# Altium schematic sheet [12] - RTC.SchDoc
size A4; Organization: Altium Limited; Address1: L3, 12a Rodborough Rd; Address2: Frenchs Forest; Address3: NSW; Address4: Australia 2086
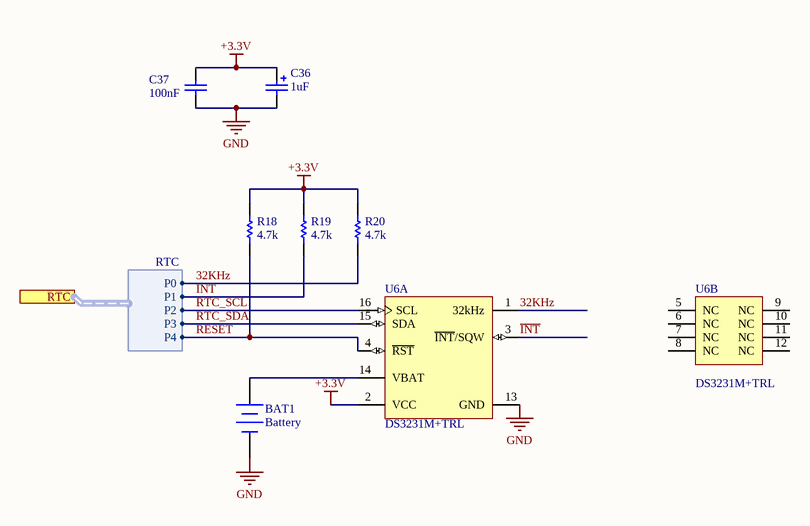
[diagram p0: [12] - RTC.SchDoc]

## Parts
BAT1  Battery  [Bat]
C36  Capacitance: 1uF  [Tantalum 3216 A]  (hidden comment: Capacitor Polarized)
C37  Capacitance: 100nF  [Cap 0603]  (hidden comment: Capacitor)
R18  Resistance: 4.7k  [Res-0603]  (hidden comment: Res1)
R19  Resistance: 4.7k  [Res-0603]  (hidden comment: Res1)
R20  Resistance: 4.7k  [Res-0603]  (hidden comment: Res1)
U6  DS3231M+TRL  [W16MK+1_N]  (parts A,B of 2)

## Ports
RTC (harness RTC)

## Harnesses
RTC: P0, P1, P2, P3, P4

## Nets
+3.3V: C36.1 C37.2 R18.1 R19.1 R20.1 U6.2(VCC)
GND: BAT1.2(-) C36.2 C37.1 U6.13(GND)
32KHz: R20.2 U6.1(32kHz) ; port RTC.P0
~{INT}: R19.2 U6.3(~{INT}/SQW) ; port RTC.P1
RESET: R18.2 U6.4(~{RST}) ; port RTC.P4
RTC_SCL: U6.16(SCL) ; port RTC.P2
RTC_SDA: U6.15(SDA) ; port RTC.P3
NetBAT1_1: BAT1.1(+) U6.14(VBAT)

Not connected (* = marked no-connect by the designer): U6 5(NC) 6(NC) 7(NC) 8(NC) 9(NC) 10(NC) 11(NC) 12(NC)

## Notes on the sheet
- Title
- Size:
- Date:
- A4
- Number:
- Time:
- Revision:
- Sheet
- of
- File:

## Library data of the parts
BAT1 = Battery: Multicell Battery; Published: 24-Mar-1999; LatestRevisionDate: 17-Jul-2002; LatestRevisionNote: Re-released for DXP Platform.; PackageReference: BAT-2; Publisher: Altium Limited; PackageDescription: Battery; 2 Leads
C36 = 4: Aluminium SMD Capacitors; Manufacturer: Panasonic; Manufacturer Part Number: EEE-1VA331P; Voltage Rating: 35V; Ripple Current (AC): 350mA; Tolerance: 20%; Polarity: Polar; Life (Hours): 2000Hour; Leakage Current: 3uA; Supplier 1: Digi-Key; Supplier Part Number 1: PCE3959DKR-ND; Stock 1: 40084; Pricing 1: 1=0.65, 10=0.482, 100=0.3304 (USD); Mount: Surface Mount,PCB; Case/Package: Radial; Contact Plating: Tin; Min Operating Temperature: -40°C; Max Operating Temperature: 85°C; Packaging: Tape and Reel; Ripple Current: 350mA; Voltage Rating (DC): 35V; Package Quantity: 500; Termination: SMD/SMT; Diameter: 10mm; Length: 10.5mm; Height: 10.2mm; Height - Seated (Max): 0.402inch; Radiation Hardening: No; REACH SVHC: No SVHC; Lead Free: Lead Free; ComponentLink1URL: https://datasheet.ciiva.com/16389/aba0000ce2-16389541.pdf; ComponentLink1Description: https://datasheet.ciiva.com/16389/aba0000ce2-16389541.pdf; ComponentLink2URL: https://datasheet.ciiva.com/30235/11aba0000ce2-30235093.pdf; ComponentLink2Description: https://datasheet.ciiva.com/30235/11aba0000ce2-30235093.pdf; ComponentLink3URL: https://datasheet.ciiva.com/46374/aba0000ce2-46374421.pdf; ComponentLink3Description: https://datasheet.ciiva.com/46374/aba0000ce2-46374421.pdf; ComponentLink4URL: https://datasheet.ciiva.com/43470/aba0000ce2-43470694.pdf; ComponentLink4Description: https://datasheet.ciiva.com/43470/aba0000ce2-43470694.pdf; ComponentLink5URL: https://datasheet.ciiva.com/14593/70255710-14593929.pdf; ComponentLink5Description: https://datasheet.ciiva.com/14593/70255710-14593929.pdf; ComponentLink6URL: https://datasheet.ciiva.com/24025/aba0000ce2-40801-24025561.pdf; ComponentLink6Description: https://datasheet.ciiva.com/24025/aba0000ce2-40801-24025561.pdf; ComponentLink7URL: https://datasheet.ciiva.com/14599/70255710-14599770.pdf; ComponentLink7Description: https://datasheet.ciiva.com/14599/70255710-14599770.pdf; ComponentLink8URL: https://datasheet.ciiva.com/17534/aba0000ce2-17534540.pdf; ComponentLink8Description: https://datasheet.ciiva.com/17534/aba0000ce2-17534540.pdf; ComponentLink9URL: https://datasheet.ciiva.com/31414/aba0000ce2-31414702.pdf; ComponentLink9Description: https://datasheet.ciiva.com/31414/aba0000ce2-31414702.pdf
C37 = 1: Chip Capacitor Nonpolar; Manufacturer: Samsung; Manufacturer Part Number: CL10B104KB8NNNC; Material: Ceramic; Dielectric: X7R; Tolerance: 10%; Voltage Rating: 50V; ComponentLink1URL: http://www.kemet.com/docfinder?Partnumber=C0603C104K5RACTU; ComponentLink1Description: http://www.kemet.com/docfinder?Partnumber=C0603C104K5RACTU; Supplier 1: Digi-Key; Supplier Part Number 1: 1276-1000-1-ND; RoHS: Yes; Stock 1: 17762403; Pricing 1: 1 = 0,10000, 10 = 0,02800, 100 = 0,01230, 500 = 0,00878, 1000 = 0,00690 (USD); Mount: Surface Mount; Case/Package: 0603; Case Code (Metric): 1608; Case Code (Imperial): 0603; Contact Plating: Tin; Min Operating Temperature: -55°C; Max Operating Temperature: 125°C; Package Quantity: 1; Packaging: Tape and Reel; Voltage: 50V; Voltage Rating (DC): 50V; Length: 1.6mm; Height: 0.8mm; Depth: 0.8mm; Width: 0.031inch; Thickness: 0.035inch; Radiation Hardening: No; Lead Free: Lead Free; ComponentLink2URL: https://datasheet.ciiva.com/25803/cl10b104kb8nnnc-25803393.pdf?src-supplier=Digi-Key; ComponentLink2Description: https://datasheet.ciiva.com/25803/cl10b104kb8nnnc-25803393.pdf?src-supplier=Digi-Key; ComponentLink3URL: https://datasheet.ciiva.com/26838/getdatasheetpartid-89097-26838411.pdf?src-supplier=Verical; ComponentLink3Description: https://datasheet.ciiva.com/26838/getdatasheetpartid-89097-26838411.pdf?src-supplier=Verical; ComponentLink4URL: https://datasheet.ciiva.com/29198/456651-da-01-en-vs-kondensator-0605-29198839.pdf?src-supplier=Conrad; ComponentLink4Description: https://datasheet.ciiva.com/29198/456651-da-01-en-vs-kondensator-0605-29198839.pdf?src-supplier=Conrad
R18-R20 = 1: Chip Resistor; Manufacturer: Panasonic; Manufacturer Part Number: ERJ-3GEYJ222V; Power Rating: 100mW; Tolerance: 5%; Voltage Rating: 75V; Temperature Coefficient: 200ppm/°C; Voltage Rating (DC): 50V; ComponentLink1URL: https://datasheet.ciiva.com/11821/0900766b80f806dd-11821453.pdf; ComponentLink1Description: https://datasheet.ciiva.com/11821/0900766b80f806dd-11821453.pdf; ComponentLink2URL: https://datasheet.ciiva.com/34303/1988639-34303614.pdf; ComponentLink2Description: https://datasheet.ciiva.com/34303/1988639-34303614.pdf; ComponentLink3URL: https://datasheet.ciiva.com/16760/70255313-16760341.pdf; ComponentLink3Description: https://datasheet.ciiva.com/16760/70255313-16760341.pdf; ComponentLink4URL: https://datasheet.ciiva.com/9117/aoa0000ce1-9117127.pdf; ComponentLink4Description: https://datasheet.ciiva.com/9117/aoa0000ce1-9117127.pdf; ComponentLink5URL: https://datasheet.ciiva.com/46380/1500035-46380411.pdf; ComponentLink5Description: https://datasheet.ciiva.com/46380/1500035-46380411.pdf; ComponentLink6URL: https://datasheet.ciiva.com/16765/70255313-16765244.pdf; ComponentLink6Description: https://datasheet.ciiva.com/16765/70255313-16765244.pdf; ComponentLink7URL: https://datasheet.ciiva.com/16199/aoa0000ce1-16199902.pdf; ComponentLink7Description: https://datasheet.ciiva.com/16199/aoa0000ce1-16199902.pdf; ComponentLink8URL: https://datasheet.ciiva.com/16853/aoa0000ce1-16853407.pdf; ComponentLink8Description: https://datasheet.ciiva.com/16853/aoa0000ce1-16853407.pdf; ComponentLink9URL: https://datasheet.ciiva.com/22758/1500035-22758223.pdf; ComponentLink9Description: https://datasheet.ciiva.com/22758/1500035-22758223.pdf; ComponentLink10URL: https://datasheet.ciiva.com/28584/1678796-28584095.pdf; ComponentLink10Description: https://datasheet.ciiva.com/28584/1678796-28584095.pdf; Supplier 1: Digi-Key; Supplier Part Number 1: P2.2KGDKR-ND; Stock 1: 1578287; Pricing 1: 1=0.1, 10=0.054, 100=0.022, 1000=0.00988, 2500=0.00858 (USD); Mount: Surface Mount; Case/Package: 0603; Case Code (Imperial): 0603; Case Code (Metric): 1608; Contact Plating: Tin; Min Operating Temperature: -55°C; Max Operating Temperature: 155°C; Package Quantity: 1; Packaging: Tape and Reel; Composition: Thick Film; Number of Terminations: 2; Military Standard: Not; Termination: SMD/SMT; Max Power Dissipation: 100mW; Features: Automotive AEC-Q200; Working Voltage: 75V; Length: 1.6mm; Height: 0.45mm; Width: 0.8mm; Depth: 0.8mm; Radiation Hardening: No; REACH SVHC: No SVHC; Lead Free: Lead Free
U6 = CMP-0254-00002-2: +/-5ppm, MEMS based Real-Time Clock, I2C Interface, 16-Pin SO, -40 to 85 degC, Pb-Free, Reel; ComponentLink2URL: http://datasheets.maxim-ic.com/en/ds/DS3231M.pdf; PackageVersion: revD, 2010; ComponentLink3Description: Package Specification; Code_JEDEC: MS-013-AA; PackageDescription: 16-Pin Small-Outline IC, Wide (0.3in), 1.27 mm Pitch, SOIC (W), Pb-Free; ComponentLink1Description: Manufacturer URL; DatasheetVersion: Rev 3, Dec-2011; Code_IPC: SOIC127P1030-16; ComponentLink3URL: http://pdfserv.maxim-ic.com/package_dwgs/21-0042.PDF; PackageReference: W16MK+1; ComponentLink1URL: http://www.maxim-ic.com; ComponentLink2Description: Datasheet